# EasyEDA schematic 1-Schematic_EMWAVER_UNO_V3.json
TITLE: Sheet_1; REV: 1.0; Date: 2022-12-25; Sheet: 1/1; Drawn By: maarnotto; Company: Your Company
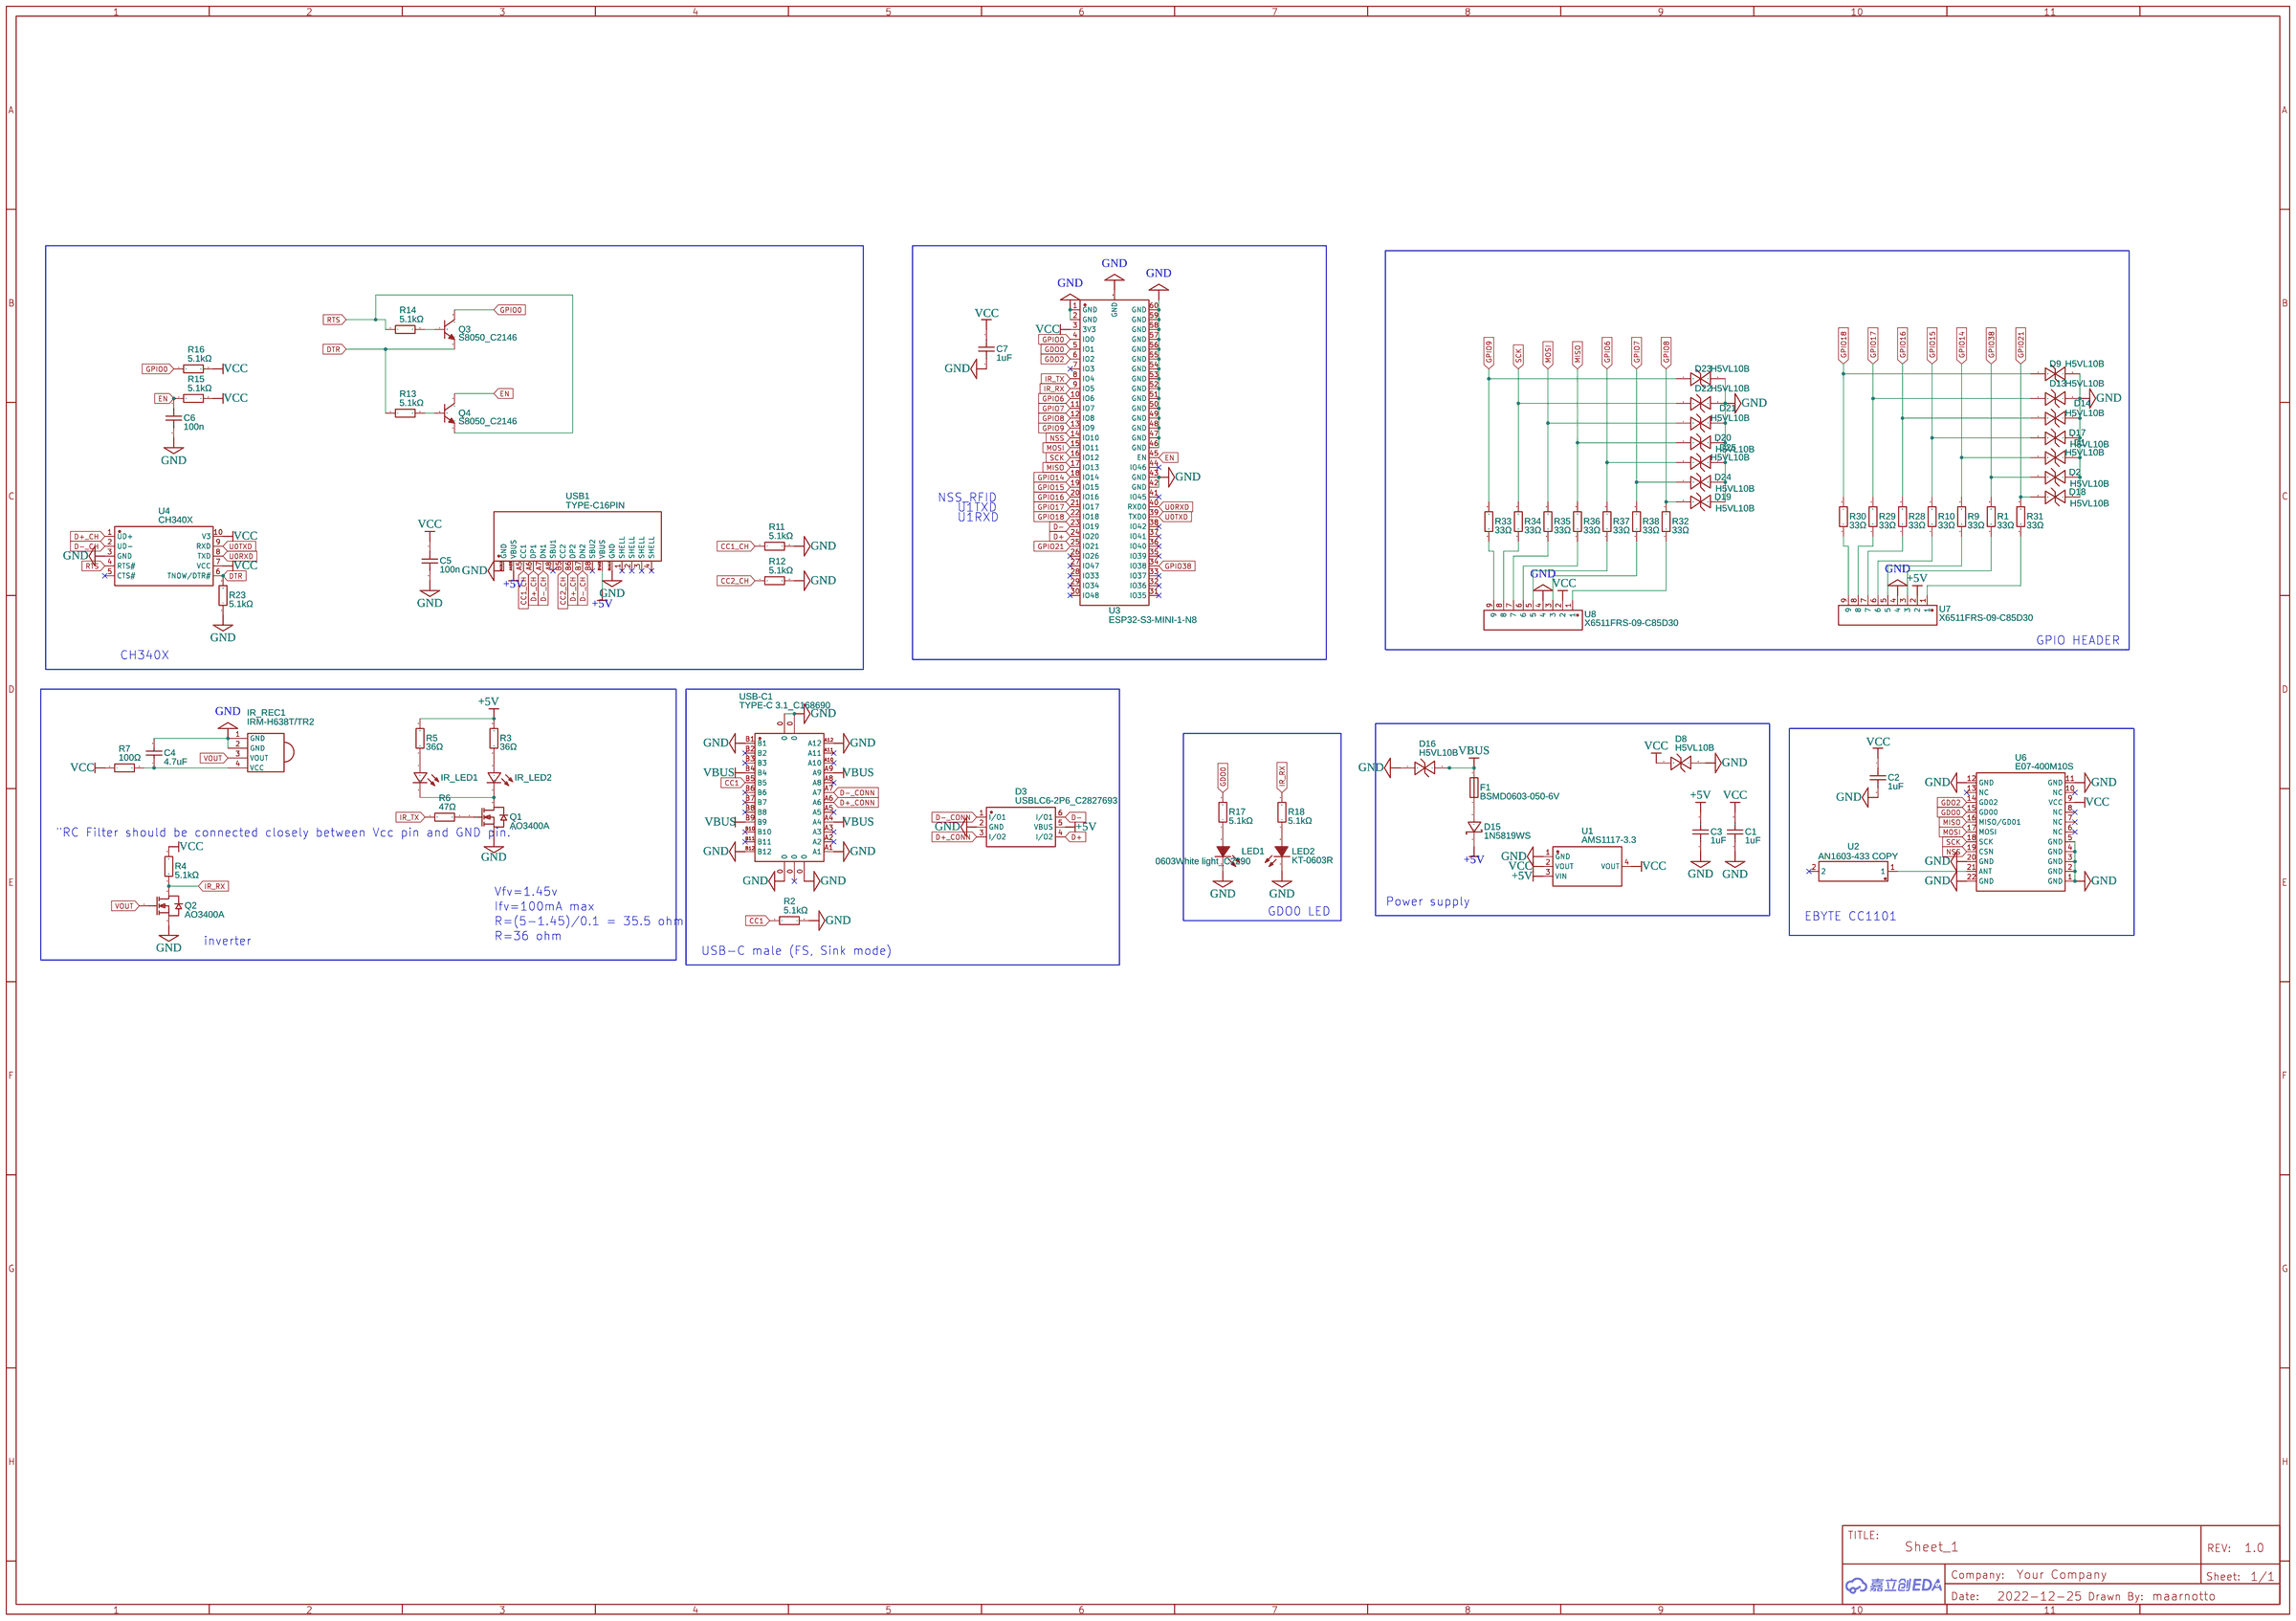
[diagram p0: schematic sheet]

## Parts
C1  1uF  [C0603]
C2  1uF  [C0603]
C3  1uF  [C0603]
C4  4.7uF  [C0603]
C5  100n  [C0402]
C6  100n  [C0402]
C7  1uF  [C0603]
D1  H5VL10B  [SOD-882_L1.0-W0.6-BI]
D2  H5VL10B  [SOD-882_L1.0-W0.6-BI]
D3  USBLC6-2P6_C2827693  [SOT-666-6_L1.6-W1.2-P0.50-LS1.6-BL]
D8  H5VL10B  [SOD-882_L1.0-W0.6-BI]
D9  H5VL10B  [SOD-882_L1.0-W0.6-BI]
D13  H5VL10B  [SOD-882_L1.0-W0.6-BI]
D14  H5VL10B  [SOD-882_L1.0-W0.6-BI]
D15  1N5819WS  [SOD-323_L1.8-W1.3-LS2.5-RD]
D16  H5VL10B  [SOD-882_L1.0-W0.6-BI]
D17  H5VL10B  [SOD-882_L1.0-W0.6-BI]
D18  H5VL10B  [SOD-882_L1.0-W0.6-BI]
D19  H5VL10B  [SOD-882_L1.0-W0.6-BI]
D20  H5VL10B  [SOD-882_L1.0-W0.6-BI]
D21  H5VL10B  [SOD-882_L1.0-W0.6-BI]
D22  H5VL10B  [SOD-882_L1.0-W0.6-BI]
D23  H5VL10B  [SOD-882_L1.0-W0.6-BI]
D24  H5VL10B  [SOD-882_L1.0-W0.6-BI]
D25  H5VL10B  [SOD-882_L1.0-W0.6-BI]
F1  BSMD0603-050-6V  [F0603]
IR_LED1  SE03-LP2835S-14100-940  [SENSOR-SMD_L3.5-W2.8-FD]
IR_LED2  SE03-LP2835S-14100-940  [SENSOR-SMD_L3.5-W2.8-FD]
IR_REC1  IRM-H638T/TR2  [SENSOR-SMD_IRM-H638T-TR2-TL]
LED1  0603White light_C2290  [LED0603-R-RD_WHITE]
LED2  KT-0603R  [LED0603-RD]
Q1  AO3400A  [SOT-23-3_L2.9-W1.6-P1.90-LS2.8-BR]
Q2  AO3400A  [SOT-23-3_L2.9-W1.6-P1.90-LS2.8-BR]
Q3  S8050_C2146  [SOT-23-3_L3.0-W1.7-P0.95-LS2.9-BR]
Q4  S8050_C2146  [SOT-23-3_L3.0-W1.7-P0.95-LS2.9-BR]
R1  33Ω  [R0402]
R2  5.1kΩ  [R0603]
R3  36Ω  [R1206]
R4  5.1kΩ  [R0603]
R5  36Ω  [R1206]
R6  47Ω  [R0805]
R7  100Ω  [R0805]
R9  33Ω  [R0402]
R10  33Ω  [R0402]
R11  5.1kΩ  [R0603]
R12  5.1kΩ  [R0603]
R13  5.1kΩ  [R0603]
R14  5.1kΩ  [R0603]
R15  5.1kΩ  [R0603]
R16  5.1kΩ  [R0603]
R17  5.1kΩ  [R0603]
R18  5.1kΩ  [R0603]
R23  5.1kΩ  [R0603]
R28  33Ω  [R0402]
R29  33Ω  [R0402]
R30  33Ω  [R0402]
R31  33Ω  [R0402]
R32  33Ω  [R0402]
R33  33Ω  [R0402]
R34  33Ω  [R0402]
R35  33Ω  [R0402]
R36  33Ω  [R0402]
R37  33Ω  [R0402]
R38  33Ω  [R0402]
U1  AMS1117-3.3  [SOT-223-3_L6.5-W3.4-P2.30-LS7.0-BR]
U2  AN1603-433 COPY  [ANT-SMD_L16.0-W3.1]
U3  ESP32-S3-MINI-1-N8  [BULETM-SMD_ESP32-S3-MINI-1-N8]
U4  CH340X  [MSOP-10_L3.0-W3.0-P0.50-LS5.0-BL]
U6  E07-400M10S  [COMM-SMD_E07-400M10S]
U7  X6511FRS-09-C85D30  [HDR-SMD_9P-P2.54-H-F-L11.5]
U8  X6511FRS-09-C85D30  [HDR-SMD_9P-P2.54-H-F-L11.5]
USB1  TYPE-C16PIN  [USB-C-SMD_TYPE-C16PIN]
USB-C1  TYPE-C 3.1_C168690  [USB-C-SMD_TYPE-C-USB-3]

## Library data of the parts
C1-C3 C5-C7 = C_0603_US: Contributor: LCEDA_Lib
C4 = CL10A475KO8NNNC: Supplier: LCSC; Manufacturer: SAMSUNG(三星); Supplier Part: C19666; JLCPCB Part Class: Basic Part
D1 D2 D8 D9 D13 D14 D16-D25 = H5VL10B: Supplier: LCSC; Supplier Part: C7420372; Manufacturer: 宏迦橙; Contributor: lcsc; JLCPCB Part Class: Extended Part
D3 = USBLC6-2P6_C2827693: Contributor: LCSC; Supplier: LCSC; Supplier Part: C2827693; Manufacturer: TECH PUBLIC(台舟); Manufacturer Part: USBLC6-2P6; JLCPCB Part Class: Extended Part
D15 = 1N5819WS: Contributor: LCSC; Supplier: LCSC; Supplier Part: C191023; Manufacturer: Hottech(合科泰); JLCPCB Part Class: Basic Part
F1 = BSMD0603-050-6V: Contributor: LCSC; Supplier: LCSC; Supplier Part: C883095; Manufacturer: BHFUSE(佰宏); JLCPCB Part Class: Extended Part
IR_LED1 IR_LED2 = SE03-LP2835S-14100-940: Contributor: lcsc; Supplier: LCSC; Supplier Part: C5205247; Manufacturer: XSSY(旭晟); JLCPCB Part Class: Extended Part
IR_REC1 = IRM-H638T/TR2: Supplier: LCSC; Manufacturer: EVERLIGHT(亿光); Supplier Part: C91447; JLCPCB Part Class: Extended Part
LED1 = 0603White light_C2290: Supplier: LCSC; Manufacturer: KENTO; Manufacturer Part: KT-0603W; Supplier Part: C2290; JLCPCB Part Class: Basic Part
LED2 = KT-0603R: Supplier: LCSC; Manufacturer: KENTO; Supplier Part: C2286; JLCPCB Part Class: Basic Part
Q1 Q2 = AO3400A: Supplier: LCSC; Manufacturer: AOS; Supplier Part: C20917; JLCPCB Part Class: Basic Part
Q3 Q4 = S8050_C2146: Supplier: LCSC; Manufacturer: CJ(江苏长电/长晶); Manufacturer Part: S8050 J3Y; Supplier Part: C2146; JLCPCB Part Class: Basic Part
R1 R9 R10 R28-R38 = 0402WGF330JTCE: Supplier: LCSC; Manufacturer: UNI-ROYAL(厚声); Supplier Part: C25105; JLCPCB Part Class: Basic Part
R2 R4 R11-R18 R23 = 0603WAF5101T5E: Supplier: LCSC; Manufacturer: UNI-ROYAL(厚声); Supplier Part: C23186; JLCPCB Part Class: Basic Part
R3 R5 = 1206W4J0360T5E: Supplier: LCSC; Manufacturer: UNI-ROYAL(厚声); Supplier Part: C25377; JLCPCB Part Class: Extended Part
R6 = 0805W8F470JT5E: Supplier: LCSC; Manufacturer: UNI-ROYAL(厚声); Supplier Part: C17714; JLCPCB Part Class: Basic Part
R7 = 0805W8F1000T5E: Supplier: LCSC; Manufacturer: UNI-ROYAL(厚声); Supplier Part: C17408; JLCPCB Part Class: Basic Part
U1 = AMS1117-3.3: sourceId: dwIGgezVh; Supplier: LCSC; Manufacturer: AMS; Supplier Part: C6186; JLCPCB Part Class: Basic Part
U2 = AN1603-433 COPY: Supplier: LCSC; Supplier Part: C122806; Manufacturer: Rainsun microwave Tech; Manufacturer Part: AN1603-433; Contributor: LCSC; JLCPCB Part Class: Extended Part
U3 = ESP32-S3-MINI-1-N8: Contributor: lcsc; Supplier: LCSC; Supplier Part: C2913206; Manufacturer: ESPRESSIF(乐鑫); JLCPCB Part Class: Extended Part
U4 = CH340X: Contributor: lcsc; Supplier: LCSC; Supplier Part: C3035748; Manufacturer: WCH(南京沁恒); JLCPCB Part Class: Extended Part
U6 = E07-400M10S: Supplier: LCSC; Supplier Part: C2965513; Manufacturer: EBYTE(亿佰特); JLCPCB Part Class: Extended Part; Contributor: lcsc
U7 U8 = X6511FRS-09-C85D30: Contributor: lcsc; Supplier: LCSC; Supplier Part: C5142242; Manufacturer: XKB Connectivity(中国星坤); JLCPCB Part Class: Extended Part
USB1 = TYPE-C16PIN: Contributor: LCSC; Supplier: LCSC; Supplier Part: C393939; Manufacturer: SHOU HAN(首韩); JLCPCB Part Class: Extended Part
USB-C1 = TYPE-C 3.1_C168690: Contributor: 立创EDA官方封装库; Supplier: LCSC; Supplier Part: C168690; Manufacturer: 精拓金; Manufacturer Part: 918-118A2021Y40000; JLCPCB Part Class: Extended Part

## Nets
+5V: C3.2 D3.5(VBUS) D15.1(K) R3.2 R5.2 U1.3(VIN) U7.2 USB1.A4B9(VBUS) USB1.B4A9(VBUS)
GND: C1.1 C2.2 C3.1 C4.2 C5.2 C6.2 C7.2 D1.2(A) D2.2(A) D3.2(GND) D8.2(A) D9.2(A) D13.2(A) D14.2(A) D16.1(C) D17.2(A) D18.2(A) D19.2(A) D20.2(A) D21.2(A) D22.2(A) D23.2(A) D24.2(A) D25.2(A) IR_REC1.1(GND) IR_REC1.2(GND) LED1.2(K) LED2.1(K) Q1.2(S) Q2.2(S) R2.2 R11.2 R12.2 R23.1 U1.1(GND) U3.1(GND) U3.2(GND) U3.42(GND) U3.43(GND) U3.46(GND) U3.47(GND) U3.48(GND) U3.49(GND) U3.50(GND) U3.51(GND) U3.52(GND) U3.53(GND) U3.54(GND) U3.55(GND) U3.56(GND) U3.57(GND) U3.58(GND) U3.59(GND) U3.60(GND) U3.GND U4.3(GND) U6.1(GND) U6.2(GND) U6.3(GND) U6.4(GND) U6.5(GND) U6.11(GND) U6.12(GND) U6.20(GND) U6.22(GND) U7.4 U8.4 USB1.A1B12(GND) USB1.B1A12(GND) USB-C1.0 USB-C1.A1 USB-C1.A12 USB-C1.B1 USB-C1.B12
VBUS: D16.2(A) F1.2 USB-C1.A4 USB-C1.A9 USB-C1.B4 USB-C1.B9
VCC: C1.2 C2.1 C5.1 C7.1 D8.1(C) R4.2 R7.1 R15.2 R16.2 U1.2(VOUT) U1.4(VOUT) U3.3(3V3) U4.7(VCC) U4.10(V3) U6.9(VCC) U8.2
CC1: R2.1 USB-C1.B5
CC1_CH: R11.1 USB1.A5(CC1)
CC2_CH: R12.1 USB1.B5(CC2)
D+: D3.4(I/O2) U3.24(IO20)
D+_CH: U4.1(UD+) USB1.A6(DP1) USB1.B6(DP2)
D+_CONN: D3.3(I/O2) USB-C1.A6
D-: D3.6(I/O1) U3.23(IO19)
D-_CH: U4.2(UD-) USB1.A7(DN1) USB1.B7(DN2)
D-_CONN: D3.1(I/O1) USB-C1.A7
DTR: Q3.2(E) R13.1 R23.2 U4.6(TNOW/DTR#)
EN: C6.1 Q4.3(C) R15.1 U3.45(EN)
GDO0: R17.2 U3.5(IO1) U6.15(GD00)
GDO2: U3.6(IO2) U6.14(GD02)
GPIO0: Q3.3(C) R16.1 U3.4(IO0)
GPIO6: D25.1(C) R37.2 U3.10(IO6)
GPIO7: D24.1(C) R38.2 U3.11(IO7)
GPIO8: D19.1(C) R32.2 U3.12(IO8)
GPIO9: D23.1(C) R33.2 U3.13(IO9)
GPIO14: D1.1(C) R9.2 U3.18(IO14)
GPIO15: D17.1(C) R10.2 U3.19(IO15)
GPIO16: D14.1(C) R28.2 U3.20(IO16)
GPIO17: D13.1(C) R29.2 U3.21(IO17)
GPIO18: D9.1(C) R30.2 U3.22(IO18)
GPIO21: D18.1(C) R31.2 U3.25(IO21)
GPIO38: D2.1(C) R1.2 U3.34(IO38)
IR_RX: Q2.3(D) R4.1 R18.2 U3.9(IO5)
IR_TX: R6.1 U3.8(IO4)
MISO: D20.1(C) R36.2 U3.17(IO13) U6.16(MISO/GD01)
MOSI: D21.1(C) R35.2 U3.15(IO11) U6.17(MOSI)
NSS: U3.14(IO10) U6.19(CSN)
RTS: Q4.2(E) R14.1 U4.4(RTS#)
SCK: D22.1(C) R34.2 U3.16(IO12) U6.18(SCK)
U0RXD: U3.40(RXD0) U4.8(TXD)
U0TXD: U3.39(TXD0) U4.9(RXD)
VOUT: IR_REC1.3(VOUT) Q2.1(G)
Net-(C4-1): C4.1 IR_REC1.4(VCC) R7.2
Net-(D15-2): D15.2(A) F1.1
Net-(IR_LED1-1): IR_LED1.1(A) R5.1
Net-(IR_LED1-2): IR_LED1.2(C) IR_LED2.2(C) Q1.3(D)
Net-(IR_LED2-1): IR_LED2.1(A) R3.1
Net-(LED1-1): LED1.1(A) R17.1
Net-(LED2-2): LED2.2(A) R18.1
Net-(Q1-1): Q1.1(G) R6.2
Net-(Q3-1): Q3.1(B) R14.2
Net-(Q4-1): Q4.1(B) R13.2
Net-(R1-1): R1.1 U7.3
Net-(R9-1): R9.1 U7.5
Net-(R10-1): R10.1 U7.6
Net-(R28-1): R28.1 U7.7
Net-(R29-1): R29.1 U7.8
Net-(R30-1): R30.1 U7.9
Net-(R31-1): R31.1 U7.1
Net-(R32-1): R32.1 U8.1
Net-(R33-1): R33.1 U8.9
Net-(R34-1): R34.1 U8.8
Net-(R35-1): R35.1 U8.7
Net-(R36-1): R36.1 U8.6
Net-(R37-1): R37.1 U8.5
Net-(R38-1): R38.1 U8.3
Net-(U2-1): U2.1 U6.21(ANT)

Not connected (* = marked no-connect by the designer): U2 2*; U3 7(IO3)* 26(IO26)* 27(IO47)* 28(IO33)* 29(IO34)* 30(IO48)* 31(IO35)* 32(IO36)* 33(IO37)* 35(IO39)* 36(IO40)* 37(IO41)* 38(IO42)* 41(IO45)* 44(IO46)*; U4 5(CTS#)*; U6 6(NC)* 7(NC)* 8(NC)* 10(NC)* 13(NC)*; USB1 1(SHELL)* 2(SHELL)* 3(SHELL)* 4(SHELL)* A8(SBU1)* B8(SBU2)*; USB-C1 A2* A3* A5* A8* A10* A11* B2* B3* B6* B7* B8* B10* B11*

## Notes on the sheet
- NSS_RFID
- U1TXD
- U1RXD
- GPIO HEADER
- CH340X
- "RC Filter should be connected closely between Vcc pin and GND pin."
- Vfv=1.45v
- Ifv=100mA max
- Power supply
- R=(5-1.45)/0.1 = 35.5 ohm
- GDO0 LED
- EBYTE CC1101
- inverter
- R=36 ohm
- USB-C male (FS, Sink mode)
